# EAGLE design USBIF_v1 (EAGLE 7.1.0)
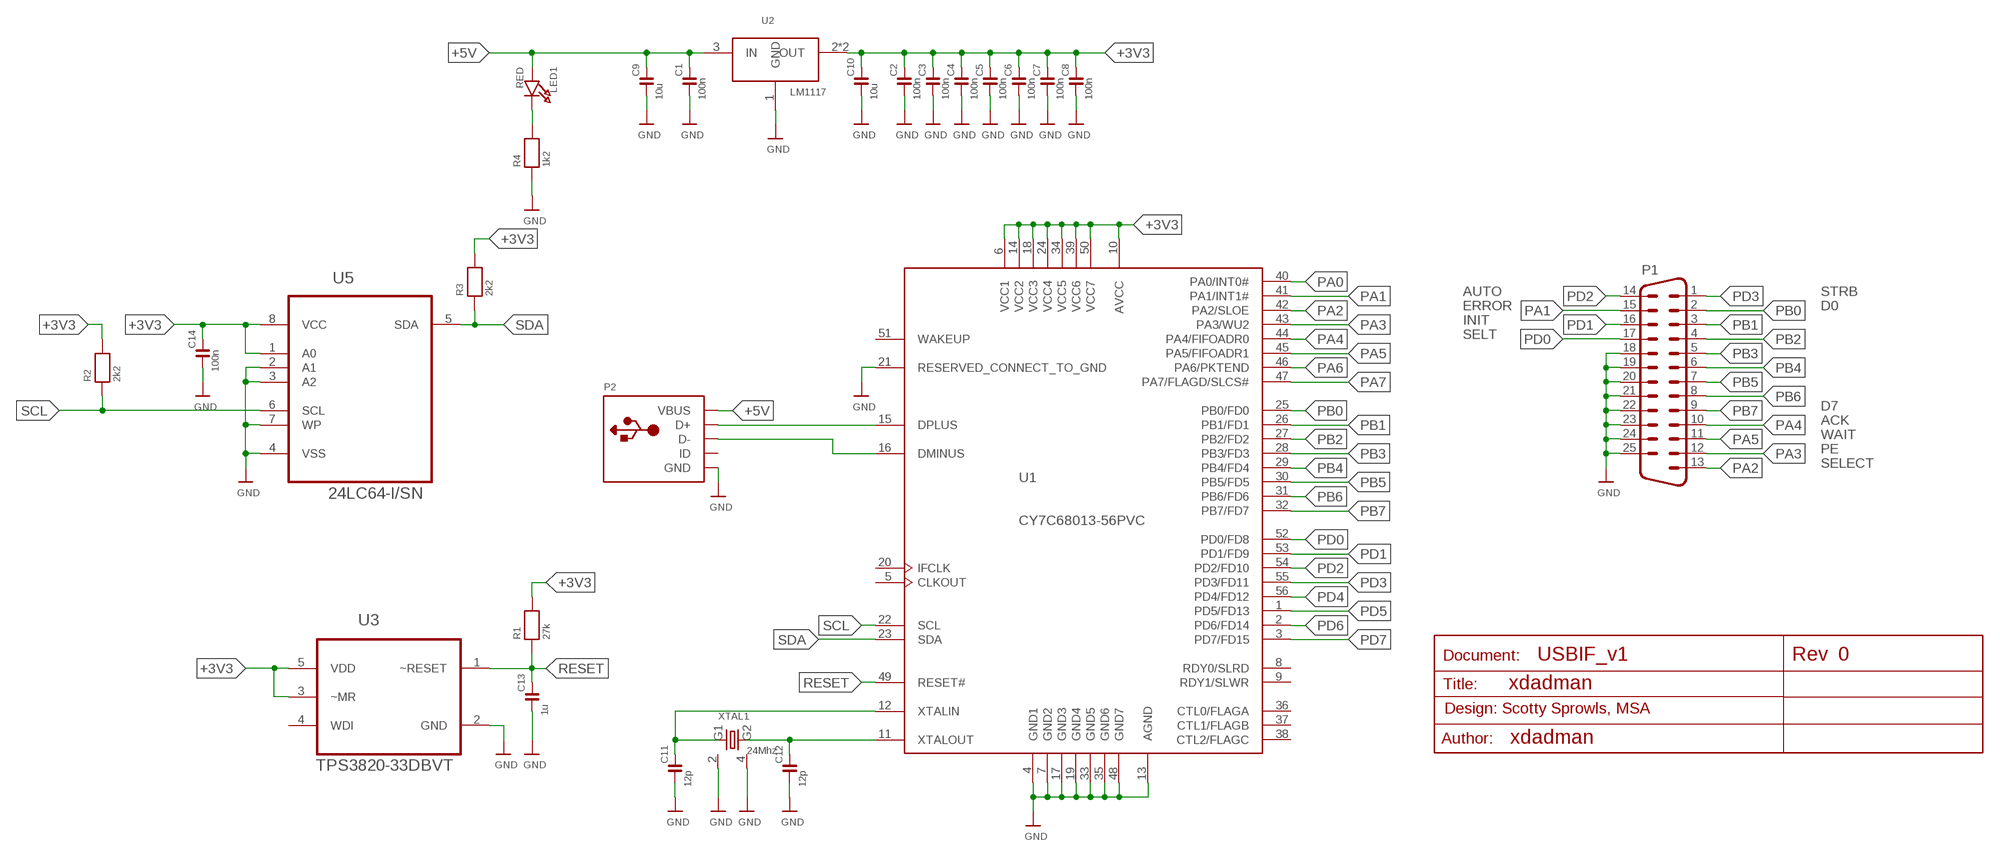
[diagram p0: schematic, sheet 1]

## Parts
C1  100n  C0805100N  [C0805]
C2  100n  CC0603100NF  [C0603]
C3  100n  CC0603100NF  [C0603]
C4  100n  CC0603100NF  [C0603]
C5  100n  CC0603100NF  [C0603]
C6  100n  CC0603100NF  [C0603]
C7  100n  CC0603100NF  [C0603]
C8  100n  CC0603100NF  [C0603]
C9  10u  CC120610U  [C1206]
C10  10u  CC120610U  [C1206]
C11  12p  CC060312P  [C0603]
C12  12p  CC060312P  [C0603]
C13  1u  C08051UF  [C0805]
C14  100n  CC0603100NF  [C0603]
LED1  RED  LED_0603_RED0603  [CHIPLED_0603]
P1  M25D  [M25D]
P2  USBMINIBLARGE  [USB-MINIB_LARGER]
R1  27k  R080527K  [R0805]
R2  2k2  R08052K2  [R0805]
R3  2k2  R08052K2  [R0805]
R4  1k2  R08051K2  [R0805]
U1  CY7C68013-56PVC  [SSOP-56]
U2  LM1117  [SOT223]
U3  TPS3820-33DBVT  [SOT95P280X145-5N]
U5  24LC64-I/SN  [SOIC127P600X175-8N_JDA2]
XTAL1  24Mhz  AKER_C7S-24.000-12-3030-X  [AKER_7X5]

## Nets
+3V3: C2.2 C3.2 C4.2 C5.2 C6.2 C7.2 C8.2 C10.2 C14.2 R1.2 R2.2 R3.2 U1.6(VCC1) U1.10(AVCC) U1.14(VCC2) U1.18(VCC3) U1.24(VCC4) U1.34(VCC5) U1.39(VCC6) U1.50(VCC7) U2.2(OUT) U2.4(OUT) U3.3(~MR) U3.5(VDD) U5.1(A0) U5.8(VCC)
+5V: C1.2 C9.2 LED1.A P2.VBUS U2.3(IN)
GND: C1.1 C2.1 C3.1 C4.1 C5.1 C6.1 C7.1 C8.1 C9.1 C10.1 C11.1 C12.1 C13.1 C14.1 P1.18 P1.19 P1.20 P1.21 P1.22 P1.23 P1.24 P1.25 P2.GND R4.1 U1.4(GND1) U1.7(GND2) U1.13(AGND) U1.17(GND3) U1.19(GND4) U1.21(RESERVED_CONNECT_TO_GND) U1.33(GND5) U1.35(GND6) U1.48(GND7) U2.1(GND) U3.2(GND) U5.2(A1) U5.3(A2) U5.4(VSS) U5.7(WP) XTAL1.2(G1) XTAL1.4(G2)
N$1: P2.D+ U1.15(DPLUS)
N$2: P2.D- U1.16(DMINUS)
N$3: LED1.C R4.2
N$11: C12.2 U1.11(XTALOUT) XTAL1.3(S2)
N$12: C11.2 U1.12(XTALIN) XTAL1.1(S1)
PA0: U1.40(PA0/INT0#)
PA1: P1.15 U1.41(PA1/INT1#)
PA2: P1.13 U1.42(PA2/SLOE)
PA3: P1.12 U1.43(PA3/WU2)
PA4: P1.10 U1.44(PA4/FIFOADR0)
PA5: P1.11 U1.45(PA5/FIFOADR1)
PA6: U1.46(PA6/PKTEND)
PA7: U1.47(PA7/FLAGD/SLCS#)
PB0: P1.2 U1.25(PB0/FD0)
PB1: P1.3 U1.26(PB1/FD1)
PB2: P1.4 U1.27(PB2/FD2)
PB3: P1.5 U1.28(PB3/FD3)
PB4: P1.6 U1.29(PB4/FD4)
PB5: P1.7 U1.30(PB5/FD5)
PB6: P1.8 U1.31(PB6/FD6)
PB7: P1.9 U1.32(PB7/FD7)
PD0: P1.17 U1.52(PD0/FD8)
PD1: P1.16 U1.53(PD1/FD9)
PD2: P1.14 U1.54(PD2/FD10)
PD3: P1.1 U1.55(PD3/FD11)
PD4: U1.56(PD4/FD12)
PD5: U1.1(PD5/FD13)
PD6: U1.2(PD6/FD14)
PD7: U1.3(PD7/FD15)
RESET: C13.2 R1.1 U1.49(RESET#) U3.1(~RESET)
SCL: R2.1 U1.22(SCL) U5.6(SCL)
SDA: R3.1 U1.23(SDA) U5.5(SDA)
Unconnected: P2.ID U1.5(CLKOUT) U1.8(RDY0/SLRD) U1.9(RDY1/SLWR) U1.20(IFCLK) U1.36(CTL0/FLAGA) U1.37(CTL1/FLAGB) U1.38(CTL2/FLAGC) U1.51(WAKEUP) U3.4(WDI)

## Notes on the sheet
- AUTO | STRB
- ERROR | D0
- INIT
- SELT
- D7
- ACK
- WAIT
- PE
- SELECT
- 0
- xdadman
- Design: Scotty Sprowls, MSA
- xdadman

## Library data of the parts
C1 = MSA_lib:C0805: Ceramic capacitor; OC_FARNELL: 1759166
C2-C8 C14 = MSA_lib:CC0603: 0603 Ceramic capacitor; OC_FARNELL: 1759016
C9 C10 = MSA_lib:CC1206: Capacitor ceramic 1206; OC_FARNELL: 1611967
C11 C12 = MSA_lib:CC0603: 0603 Ceramic capacitor; OC_FARNELL: 1828907
C13 = MSA_lib:C0805: Ceramic capacitor; OC_FARNELL: 9527710
LED1 = MSA_lib:LED_0603_RED: Chip LED 0603 RED 2ma; OC_FARNELL: 1685068
P1 = MSA_lib:M25: SUB-D; OC_FARNELL: 1084674
P2 = MSA_lib:USB: USB Connectors USBMINIB - Surface Mount Female Mini-B USB Connector 4UConnector: 06564
R1 = MSA_lib:R0805: Resistors; OC_FARNELL: 2332090
R2 R3 = MSA_lib:R0805: Resistors; OC_FARNELL: 2332076
R4 = MSA_lib:R0805: Resistors; OC_FARNELL: 9333827
U1 = MSA_lib:CY7C68013-56PVC: Cypress EZ-USB FX2; OC_FARNELL: 1269134
U2 = MSA_lib:LM1117: LDO 3.3V LM1117; OC_FARNELL: 2323580
U3 = MSA_lib:TPS3820-33DBVT: PROCESSOR SUPERVISORY CIRCUITS; MPN: TPS3820-33DBVT; OC_FARNELL: 8457212; OC_NEWARK: 77C0414; PACKAGE: SOT-23-5; SUPPLIER: Texas Instruments
U5 = MSA_lib:24LC64-I/SN: 64K I2C Serial EEPROM; MPN: 24LC64-I/SN; OC_FARNELL: 9758070; OC_NEWARK: 12C2020; PACKAGE: SOIC-8; SUPPLIER: MICROCHIP
XTAL1 = MSA_lib:AKER_C7S-24.000-12-3030-X; OC_FARNELL: 1538819

## Board
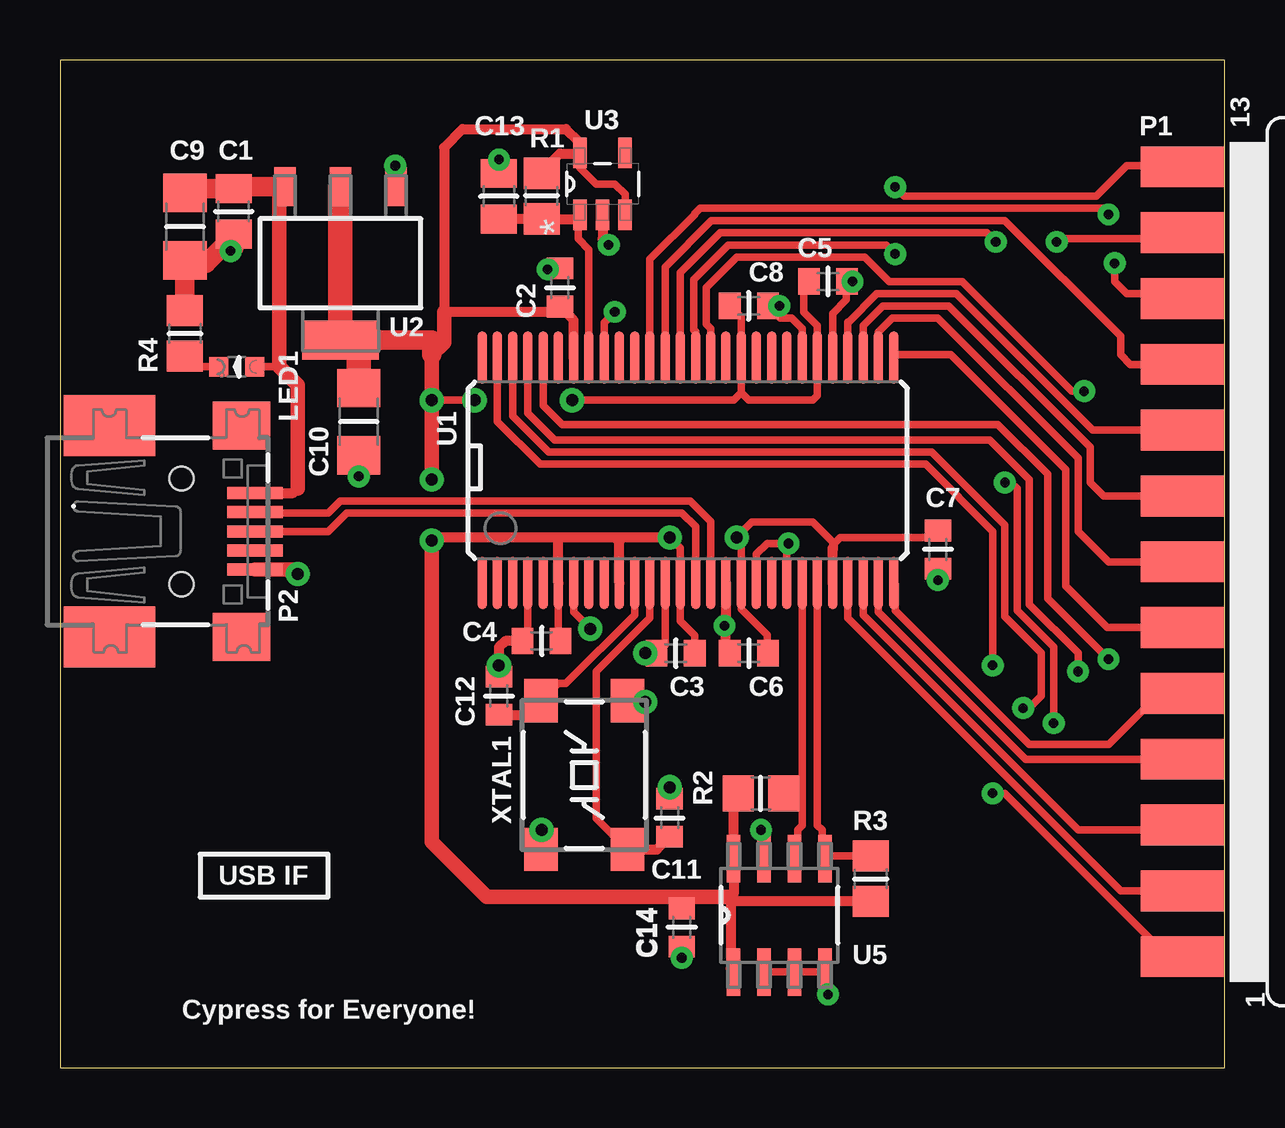
[diagram p1: board, top side]
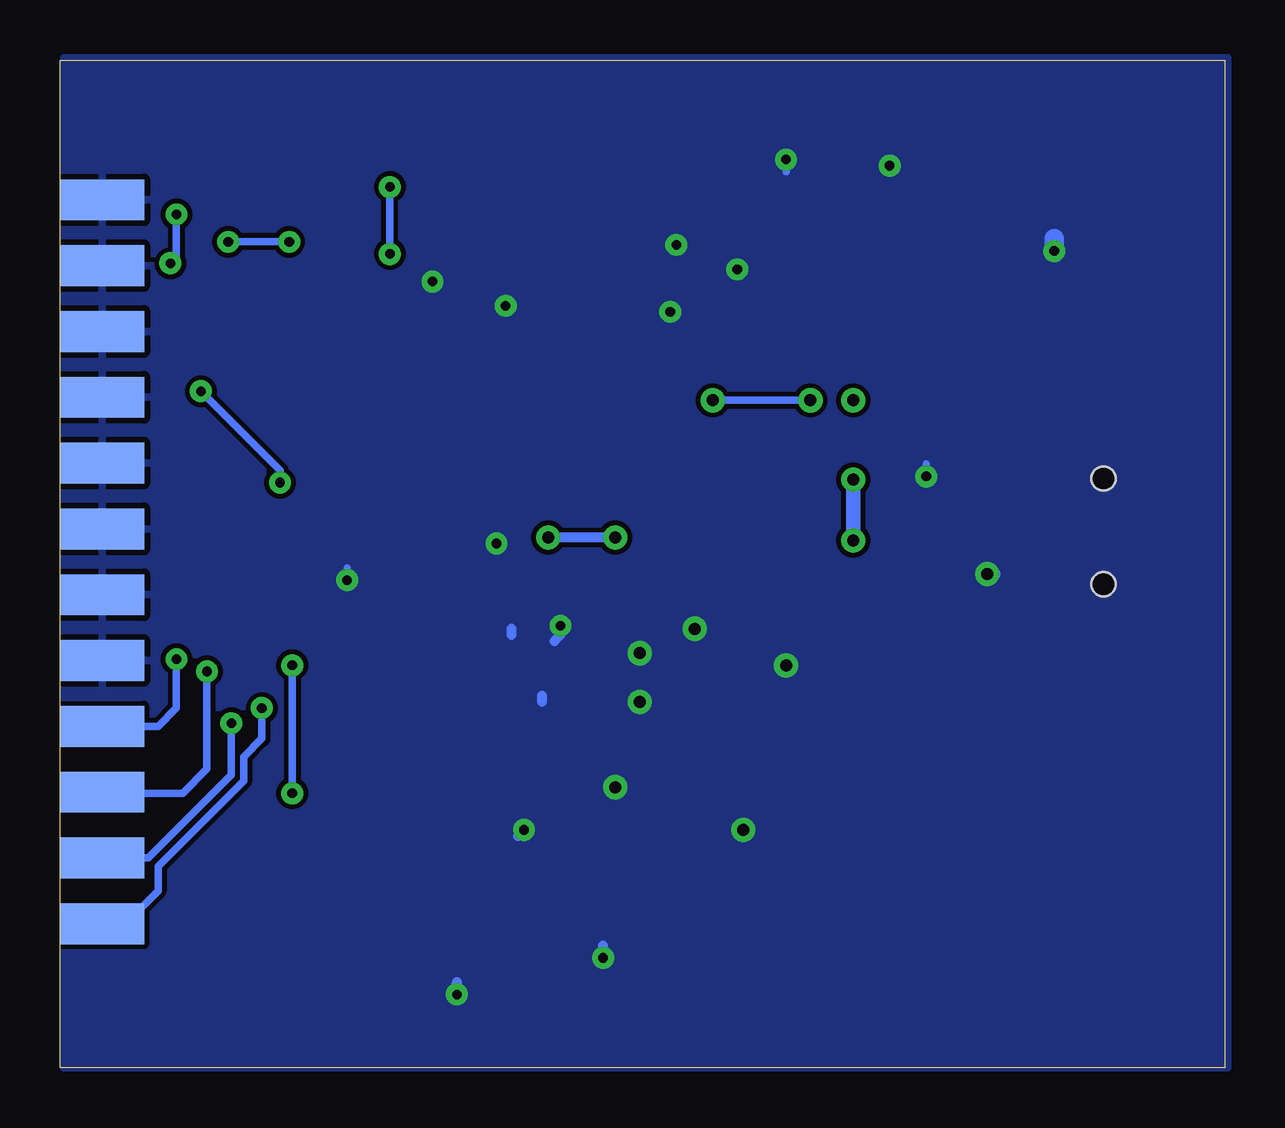
[diagram p2: board, bottom side, seen from below]

Size 48.54 x 42 mm. Coordinates in mm from the lower left corner, seen from the top.
Outline: 0,0 48.54,0 48.54,42 0,42 0,0
Copper layers (1*16): Top 0.035mm / dielectric 1.5mm / Bottom 0.035mm
Design rules "kuba_no_CLR": minimum track width 8mil, minimum drill 15mil, track to track 8mil, track to pad 8mil, pad to pad 8mil, via to via 8mil, smd to smd 8mil, copper to edge 0mil, drill to drill 8mil, minimum pad ring 12mil, minimum via ring 10mil, stop-mask expansion 4mil, vias tented up to drill 0mil, thermal gap 10mil

### Footprints (pad centres in the part's own frame; a part is rotated, then mirrored left to right if it is on the bottom)
C0805 = smd 1.2 x 1.5: 1 -0.953,0; 2 0.953,0
C0603 = smd 0.9 x 1.1: 1 -0.794,0; 2 0.794,0
C1206 = smd 1.6 x 1.8: 1 -1.4,0; 2 1.4,0
CHIPLED_0603 = smd 0.8 x 0.8: A 0,-0.75; C 0,0.75
M25D = smd 1.7 x 3.5: 1 16.459,-6.045; 2 13.716,-6.045; 3 10.973,-6.045; 4 8.23,-6.045; 5 5.486,-6.045; 6 2.743,-6.045; 7 0,-6.045; 8 -2.743,-6.045; 9 -5.486,-6.045; 10 -8.23,-6.045; 11 -10.973,-6.045; 12 -13.716,-6.045; 13 -16.459,-6.045 | smd 1.7 x 3.5 bottom: 14 15.088,-6.045; 15 12.344,-6.045; 16 9.601,-6.045; 17 6.858,-6.045; 18 4.115,-6.045; 19 1.372,-6.045; 20 -1.372,-6.045; 21 -4.115,-6.045; 22 -6.858,-6.045; 23 -9.601,-6.045; 24 -12.344,-6.045; 25 -15.088,-6.045
USB-MINIB_LARGER = smd 0.5 x 2.308: D+ 0,4.064; D- -0.8,4.064; GND 1.6,4.064; ID 0.8,4.064; VBUS -1.6,4.064 | smd 2.54 x 3.81: GND1 -4.4,-2; GND4 4.4,-2 | smd 2 x 2.4: GND2 -4.4,3.5; GND3 4.4,3.5 | hole 1: -2.2,1; 2.2,1
R0805 = smd 1.3 x 1.5: 1 -0.95,0; 2 0.95,0
SSOP-56 = smd 2.2 x 0.4: 1 -4.7,8.572; 2 -4.7,7.938; 3 -4.7,7.303; 4 -4.7,6.668; 5 -4.7,6.032; 6 -4.7,5.397; 7 -4.7,4.763; 8 -4.7,4.128; 9 -4.7,3.493; 10 -4.7,2.857; 11 -4.7,2.223; 12 -4.7,1.587; 13 -4.7,0.953; 14 -4.7,0.318; 15 -4.7,-0.318; 16 -4.7,-0.953; 17 -4.7,-1.587; 18 -4.7,-2.223; 19 -4.7,-2.857; 20 -4.7,-3.493; 21 -4.7,-4.128; 22 -4.7,-4.763; 23 -4.7,-5.397; 24 -4.7,-6.032; 25 -4.7,-6.668; 26 -4.7,-7.303; 27 -4.7,-7.938; 28 -4.7,-8.572; 29 4.7,-8.572; 30 4.7,-7.938; 31 4.7,-7.303; 32 4.7,-6.668; 33 4.7,-6.032; 34 4.7,-5.397; 35 4.7,-4.763; 36 4.7,-4.128; 37 4.7,-3.493; 38 4.7,-2.857; 39 4.7,-2.223; 40 4.7,-1.587; 41 4.7,-0.953; 42 4.7,-0.318; 43 4.7,0.318; 44 4.7,0.953; 45 4.7,1.587; 46 4.7,2.223; 47 4.7,2.857; 48 4.7,3.493; 49 4.7,4.128; 50 4.7,4.763; 51 4.7,5.397; 52 4.7,6.032; 53 4.7,6.668; 54 4.7,7.303; 55 4.7,7.938; 56 4.7,8.572
SOT223 = smd 1.626 x 0.889: 1 -3.2,2.311; 2 -3.2,0; 3 -3.2,-2.311 | smd 1.626 x 3.175: 4 3.2,0
SOT95P280X145-5N = smd 1.27 x 0.559: 1 -1.295,0.94; 2 -1.295,0; 3 -1.295,-0.94; 4 1.295,-0.94; 5 1.295,0.94
SOIC127P600X175-8N_JDA2 = smd 1.981 x 0.559: 1 -2.362,1.905; 2 -2.362,0.635; 3 -2.362,-0.635; 4 -2.362,-1.905; 5 2.362,-1.905; 6 2.362,-0.635; 7 2.362,0.635; 8 2.362,1.905
AKER_7X5 = smd 1.8 x 1.4: 1 -3.1,-1.8; 2 3.1,-1.8; 3 3.1,1.8; 4 -3.1,1.8

### Placement (x,y rotation side)
C1  7.24,35.69 90 top
C2  20.83,32.51 270 top
C3  25.65,17.27 0 top
C4  20.07,17.78 0 top
C5  32,32.77 180 top
C6  28.7,17.27 0 top
C7  36.58,21.59 90 top
C8  28.7,31.75 180 top
C9  5.21,35.05 90 top
C10  12.45,26.92 90 top
C11  25.4,10.41 270 top
C12  18.29,15.49 270 top
C13  18.29,36.32 270 top
C14  25.91,5.84 90 top
LED1  7.37,29.21 90 top
P1  52.83,21.08 270 top
P2  4.06,22.35 270 top
R1  20.07,36.32 90 top
R2  29.21,11.43 180 top
R3  33.78,7.87 270 top
R4  5.21,30.61 270 top
U1  26.16,24.89 90 top
U2  11.68,33.53 270 top
U3  22.61,36.83 90 top
U5  29.97,6.35 90 top
XTAL1  21.84,12.19 90 top

### Tracks (layer width: path | path; a pad name or v marks a point on that pad's centre or on a via)
+3V3  (via drill 0.5)
  Top 0.305: U1.6 20.77,17.88 C4.2 | C3.2 26.45,18 25.84,18.61 U1.14 25.84,21.65 v25.4,22.1 | C8.2 28.38,31.27 U1.39 28.38,28.13 | U1.24 32.19,21.53 | U3.5 21.67,37.52 22.35,36.83 23.11,36.83 23.55,36.4 U3.3 | 28.38,28.13 28.07,27.81 v21.34,27.81 | 28.38,28.13 28.7,27.81 31.37,27.81 31.56,28 U1.34 31.56,30.92 30.99,31.5 30.99,32.54 C5.2 | v28.19,22.1 28.83,22.73 31.37,22.73 32.19,21.91 32.19,21.65 32.26,21.59 32.26,21.84 32.51,22.1 36.29,22.1 C7.2 | v17.27,27.81 v15.49,27.81 | 28.38,21.91 U1.18 28.38,19.11 29.46,18.03 29.46,17.3 C6.2 | 20.83,31.5 C2.2
  Top 0.406: R1.2 20.07,37.34 20.83,38.1 21.64,38.1 U3.5 21.59,38.2 21.59,38.61 21.08,39.12 16.76,39.12 16,38.35 16,31.5 20.83,31.5 | v25.4,22.1 23.11,22.1 | 23.11,22.1 20.83,22.1 | 20.83,22.1 15.49,22.1 | U1.6 20.77,22.04 20.83,22.1 | U1.10 23.3,21.91 23.11,22.1 | 28.38,21.91 v28.19,22.1 | U1.24 32.19,21.65 | 27.94,6.86 27.94,7.11 28.07,7.24 U5.8 28.07,11.24 R2.2 | 27.94,6.86 27.94,4.12 U5.1 | R3.2 28.01,6.92 27.94,6.86 | C14.2 25.91,7.11 | 21.4,27.88 v21.34,27.81 | U1.50 21.4,31.15 C2.2
  Top 0.61: v15.49,24.51 v15.49,27.81 15.49,29.72 16,30.23 16,31.5 | 15.49,22.1 v15.49,21.97 15.49,9.4 17.78,7.11 25.91,7.11 27.94,7.11
  Top 0.813: U2.4 12.19,30.33 15.49,30.33 15.49,29.72
  Top 1.016: U2.2 U2.4 | C10.2 12.45,30.07 12.19,30.33
  Bottom 0.305: v21.34,27.81 v17.27,27.81
  Bottom 0.406: v25.4,22.1 v28.19,22.1
  Bottom 0.61: v15.49,24.51 v15.49,21.97
+5V
  Top 0.305: LED1.A 9.14,29.21
  Top 0.406: P2.VBUS 9.73,23.95 9.91,24.13
  Top 0.61: 9.91,24.13 9.91,28.45 9.14,29.21 9.14,36.5 U2.3
  Top 0.813: U2.3 7.33,36.73 C1.2 5.39,36.64 C9.2
GND  (via drill 0.4, 0.5)
  Top 0.305: U1.4 19.49,18 C4.1 | U1.13 25.21,17.62 C3.1 | U5.4 U5.3 U5.2 | U1.7 21.4,18.99 v22.1,18.29 | U1.48 22.67,31.05 v23.11,31.5 | U1.35 30.92,30.8 30.48,31.24 30,31.24 C8.1 v29.97,31.75 | U1.33 32.19,31.43 32.77,32 32.77,32.73 C5.1 v33.02,32.77 | U1.21 30.29,21.91 v30.35,21.84 29.46,21.84 29.02,21.4 U1.19 | v36.58,20.32 C7.1 | C10.1 v12.45,24.64 | C13.1 v18.29,37.85
  Top 0.406: C4.1 18.54,17.78 18.29,17.53 v18.29,16.76 C12.1 | C11.1 v25.4,11.68 | XTAL1.2 24.33,15.29 v24.38,15.24 | XTAL1.4 20.04,10.14 v20.07,9.91 | C3.1 v24.38,17.27 | U5.4 31.88,3.17 v32,3.05 | 25.91,5.08 C14.1 v25.91,4.57 | U5.7 29.34,9.78 v29.21,9.91 | C2.1 20.35,33.31 v20.32,33.27 | U3.2 22.61,34.54 v22.86,34.29 | U1.17 27.75,18.35 | C6.1 27.75,17.43 27.75,18.35 | 27.75,18.35 v27.69,18.41 | U2.1 13.99,37.57 v13.97,37.59
  Top 0.61: P2.GND 9.73,20.75 v9.91,20.57
  Top 0.813: R4.1 C9.1 5.33,33.53 6.1,33.53 7.24,34.67 C1.1 7.24,34.16 v7.11,34.04
  Bottom 0.305: v22.1,18.29 21.84,18.29 | 27.43,18.41 v27.69,18.41 | v36.58,20.32 36.58,20.83 | v23.11,31.5 22.86,31.5 | v29.97,31.75 29.72,31.75 | v30.35,21.84 30.1,21.84 | v12.45,24.64 12.45,25.15 | v18.29,37.85 18.29,37.34
  Bottom 0.406: v25.4,11.68 25.4,11.43 | v24.38,15.24 24.64,15.24 | v24.38,17.27 24.64,17.27 | 29.72,18.03 29.72,18.29 | 28.45,15.24 28.45,15.49 | v32,3.05 32,3.56 | v25.91,4.57 25.91,5.08 | v29.21,9.91 29.46,9.65 | v20.32,33.27 20.57,33.27 | v22.86,34.29 22.61,34.29 | v27.69,18.41 27.69,18.03 27.94,17.78 | v13.97,37.59 13.97,37.34
  Bottom 0.61: v9.91,20.57 9.65,20.57
  Bottom 0.813: v7.11,34.04 7.11,34.54
  pour Bottom: -0.11,-0.02 48.37,-0.02 48.37,42.1 -0.11,42.1
N$1
  Top 0.305: U1.15 26.48,22.54 25.91,23.11 11.94,23.11 11.18,22.35 P2.D+
N$2
  Top 0.305: U1.16 27.11,22.76 26.25,23.62 11.68,23.62 11.18,23.11 8.17,23.11 P2.D-
N$3
  Top 0.305: LED1.C 5.65,29.21 R4.2
N$11
  Top 0.305: U1.11 23.94,18.86 21.08,16 20.75,16 XTAL1.3
  Top 0.406: C12.2 19.78,14.7 19.81,14.73 19.81,15.06 XTAL1.3
N$12
  Top 0.305: U1.12 24.57,18.73 22.35,16.51 22.35,10.38 XTAL1.1
  Top 0.406: XTAL1.1 24.87,9.09 C11.2
PA1  (via drill 0.4)
  Top 0.305: U1.41 27.11,30.8 26.92,30.99 26.92,32.51 28.19,33.78 33.53,33.78 34.54,32.77 37.59,32.77 42.16,28.19 v42.67,28.19 | v41.4,14.35 41.4,17.53 39.88,19.05 39.88,24.13 39.62,24.38 v39.37,24.38
  Bottom 0.305: P1.15 44.86,8.74 41.4,12.19 v41.4,14.35 | v39.37,24.38 39.37,24.89 v42.67,28.19
PA2  (via drill 0.4)
  Top 0.305: U1.42 26.48,30.67 26.42,30.73 26.42,32.85 27.85,34.29 34.42,34.29 v34.8,33.91 | v34.8,36.7 35.18,36.32 43.18,36.32 44.45,37.59 46.74,37.59 P1.13
  Bottom 0.305: v34.8,33.91 v34.8,36.7
PA3  (via drill 0.4)
  Top 0.305: U1.43 25.84,33.13 27.51,34.8 38.61,34.8 v38.99,34.42 | P1.12 46.53,34.54 41.66,34.54 v41.53,34.42
  Bottom 0.305: v38.99,34.42 v41.53,34.42
PA4
  Top 0.305: U1.44 25.21,33.37 27.14,35.31 39.37,35.31 44.2,30.48 44.2,29.72 44.6,29.31 P1.10
PA5  (via drill 0.4)
  Top 0.305: U1.45 24.57,33.69 26.44,35.56 26.44,35.59 26.67,35.81 43.43,35.81 v43.69,35.56 | v43.94,33.53 43.94,32.77 44.45,32.26 46.58,32.26 P1.11
  Bottom 0.305: v43.69,35.56 43.69,33.78 v43.94,33.53
PB0
  Top 0.305: U1.25 32.83,18.73 44.2,7.37 P1.2
PB1
  Top 0.305: U1.26 33.47,18.86 42.42,9.91 46.58,9.91 P1.3
PB2
  Top 0.305: U1.27 34.1,18.99 40.23,12.85 P1.4
PB3
  Top 0.305: U1.28 34.8,20.13 34.8,19.05 40.39,13.46 43.69,13.46 45.72,15.49 46.74,15.49 47.5,16.26 47.45,16.26 P1.5
PB4
  Top 0.305: P1.6 43.64,18.34 41.91,20.07 41.91,24.93 37.12,29.72 34.86,29.72 U1.29
PB5
  Top 0.305: U1.30 34.1,30.66 34.69,31.24 36.58,31.24 42.42,25.4 42.42,22.35 43.69,21.08 P1.7
PB6
  Top 0.305: U1.31 33.47,30.92 34.29,31.75 37.04,31.75 42.93,25.86 42.93,24.38 43.48,23.82 P1.8
PB7
  Top 0.305: U1.32 32.83,31.08 32.85,31.08 34.04,32.26 37.34,32.26 43.03,26.57 P1.9
PD0  (via drill 0.4)
  Top 0.305: U1.52 20.13,27.6 20.93,26.8 39.08,26.8 41.15,24.73 41.15,19.56 v43.69,17.02
  Bottom 0.305: v43.69,17.02 43.69,14.99 44.45,14.22 P1.17
PD1  (via drill 0.4)
  Top 0.305: U1.53 19.49,27.29 20.62,26.16 38.74,26.16 40.39,24.52 40.39,19.3 42.42,17.27 v42.42,16.51
  Bottom 0.305: v42.42,16.51 42.42,12.45 43.43,11.43 46.74,11.43 P1.16
PD2  (via drill 0.4)
  Top 0.305: U1.54 18.86,27.15 20.36,25.65 36.32,25.65 39.37,22.61 39.37,18.8 40.89,17.27 40.89,15.49 40.39,14.99 v40.13,14.99
  Bottom 0.305: 46.69,6.1 P1.14 46.43,6.35 45.47,6.35 44.45,7.37 44.45,8.38 40.89,11.94 40.89,12.95 40.13,13.72 v40.13,14.99
PD3  (via drill 0.4)
  Top 0.305: U1.55 18.22,26.93 20,25.15 36.07,25.15 38.86,22.35 v38.86,16.76 | 46.58,4.83 P1.1 46.74,4.57 46.23,4.57 39.37,11.43 v38.86,11.43
  Bottom 0.305: v38.86,16.76 v38.86,11.43
RESET
  Top 0.305: U1.49 22.04,34.1 21.59,34.54 21.59,35.46 U3.1 21.58,35.62
  Top 0.406: U3.1 21.5,35.37 R1.1 C13.2
SCL
  Top 0.305: U1.22 30.92,11.18 | 30.92,11.18 30.92,10.1 30.73,9.91 30.73,8.84 U5.6 | R2.1 30.67,11.43 30.92,11.18
SDA
  Top 0.305: U1.23 31.56,10.1 31.75,9.91 31.75,8.84 U5.5 31.99,8.82 | 32,8.84 31.99,8.82 | R3.1 31.99,8.82

### Text on the board
tPlace: C13 | U3 | P1 | C9 | C1 | R1 | C5 | C8 | C2 | U2 | R4 | LED1 | U1 | C10 | C7 | P2 | C4 | C3 | C6 | C12 | R2 | XTAL1 | R3 | USB IF | C11 | C14 | U5 | Cypress for Everyone!